# EAGLE design Advance_Infinite_Thick (EAGLE 9.6.2)
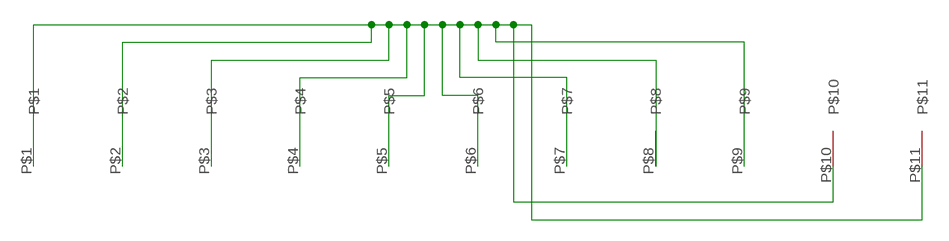
[diagram p0: schematic, sheet 1]

## Parts
U$1  PINEDGE  [PINEDGE]

## Nets
N$2: U$1.P$1 U$1.P$2 U$1.P$3 U$1.P$4 U$1.P$5 U$1.P$6 U$1.P$7 U$1.P$8 U$1.P$9 U$1.P$10 U$1.P$11

## Library data of the parts
U$1 = pinedge:PINEDGE

## Board
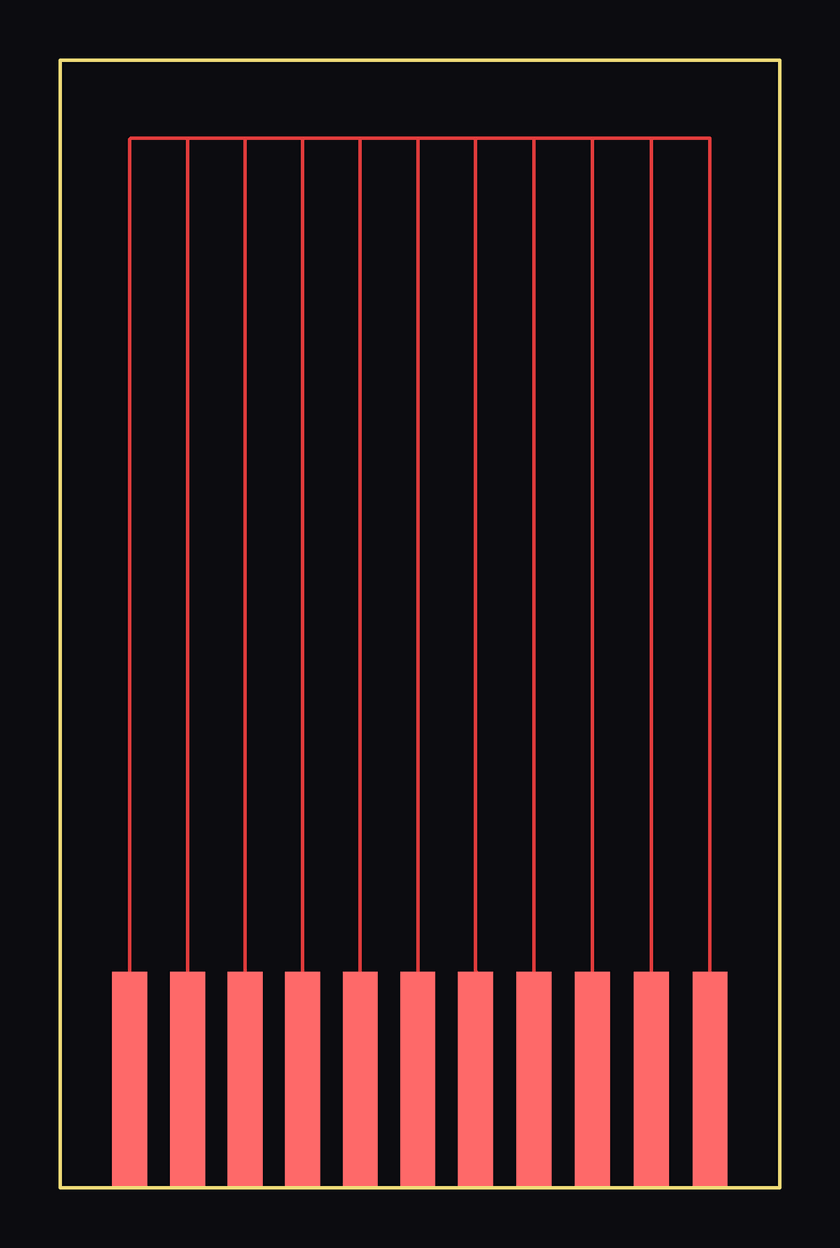
[diagram p1: board, top side]

Size 30 x 47 mm. Coordinates in mm from the lower left corner, seen from the top.
Outline: 0,47 30,47 30,0 0,0 0,47
Copper layers (1*16): Top 0.035mm / dielectric 1.5mm / Bottom 0.035mm
Design rules "default": minimum track width 6mil, minimum drill 0.35mm, track to track 6mil, track to pad 6mil, pad to pad 6mil, via to via 6mil, smd to smd 6mil, copper to edge 40mil, drill to drill 6mil, minimum pad ring 10mil, minimum via ring 8mil, stop-mask expansion 4mil, vias tented up to drill 0mil, thermal gap 10mil

### Footprints (pad centres in the part's own frame; a part is rotated, then mirrored left to right if it is on the bottom)
PINEDGE = smd 1.45 x 9: P$1 0.75,0.5; P$2 3.168,0.5; P$3 5.568,0.5; P$4 7.968,0.5; P$5 10.368,0.5; P$6 12.768,0.5; P$7 15.168,0.5; P$8 17.604,0.5; P$9 20.05,0.5; P$10 22.5,0.5; P$11 24.95,0.5

### Placement (x,y rotation side)
U$1  2.15,4 0 top

### Tracks (layer width: path | path; a pad name or v marks a point on that pad's centre or on a via)
N$2
  Top 0.152: 2.89,4.52 U$1.P$1 2.9,43.7 2.95,43.75 5.3,43.75 | U$1.P$3 7.72,43.72 7.75,43.75 | U$1.P$4 10.12,43.67 10.2,43.75 | 15,4.6 U$1.P$6 14.92,43.72 14.95,43.75 | 17.37,9 17.32,9 U$1.P$7 17.32,43.72 17.35,43.75 | U$1.P$11 27.1,43.75 24.6,43.75 | 5.3,43.75 7.75,43.75 | 7.75,43.75 10.2,43.75 | 10.2,43.75 12.6,43.75 | 12.6,43.75 14.95,43.75 | 14.95,43.75 17.35,43.75 | 17.35,43.75 19.8,43.75 | 19.8,43.75 22.2,43.75 | 22.2,43.75 24.6,43.75 | 24.6,43.75 24.65,43.7 U$1.P$10 | U$1.P$9 22.2,43.75 | 19.8,43.75 19.76,43.7 U$1.P$8 | 12.6,43.75 12.52,43.67 U$1.P$5 | 5.3,43.75 5.32,43.73 U$1.P$2